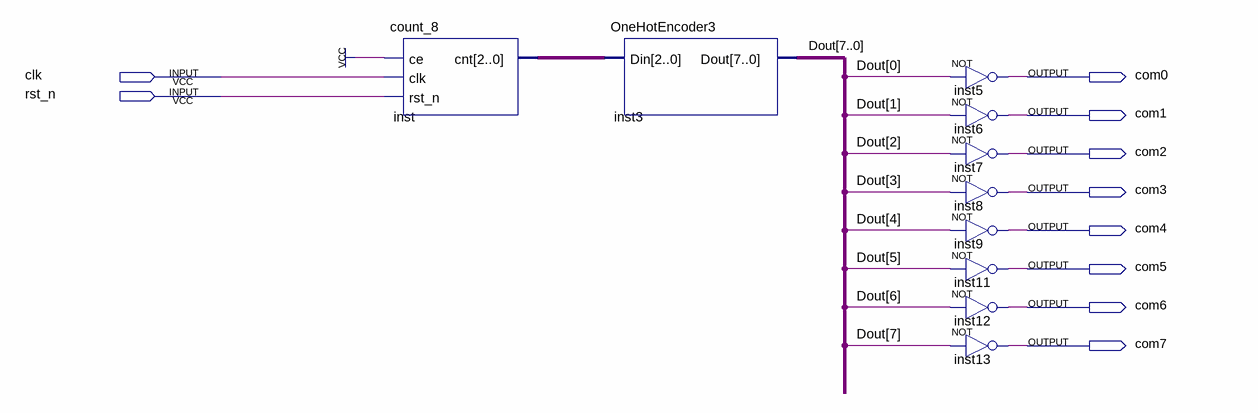
[diagram p0: schematic sheet]
// Quartus schematic count_com.bdf as structural Verilog: 10 symbols, 10 pins
module count_com (
  input  clk,
  input  rst_n,
  output com0,
  output com1,
  output com2,
  output com3,
  output com4,
  output com5,
  output com6,
  output com7
);

  wire [2:0] inst_cnt;
  wire [7:0] Dout;

  count_8 inst (.ce(1'b1), .clk(clk), .rst_n(rst_n), .cnt(inst_cnt));
  OneHotEncoder3 inst3 (.Din(inst_cnt), .Dout(Dout));
  not inst5 (com0, Dout[0]);
  not inst6 (com1, Dout[1]);
  not inst7 (com2, Dout[2]);
  not inst8 (com3, Dout[3]);
  not inst9 (com4, Dout[4]);
  not inst11 (com5, Dout[5]);
  not inst12 (com6, Dout[6]);
  not inst13 (com7, Dout[7]);
endmodule
